# EAGLE design DoorBell (EAGLE 7.7.0)
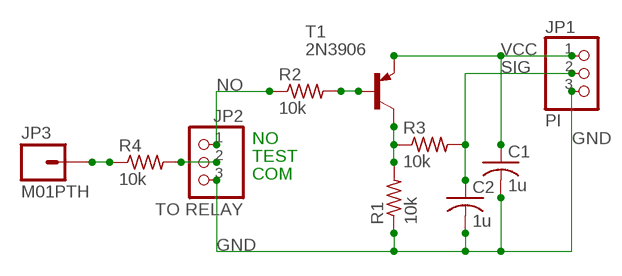
[diagram p0: schematic, sheet 1]

## Parts
C1  1u  C-US025-025X050  [C025-025X050]
C2  1u  C-US025-025X050  [C025-025X050]
JP1  PI  PINHD-1X3  [1X03]
JP2  TO RELAY  PINHD-1X3  [1X03]
JP3  M01PTH  [1X01]
R1  10k  R-US_0204/5  [0204/5]
R2  10k  R-US_0204/5  [0204/5]
R3  10k  R-US_0204/5  [0204/5]
R4  10k  R-US_0204/5  [0204/5]
T1  2N3906  2N3906-PNP-TO92-EBC  [TO92-EBC]

## Nets
GND: C1.2 C2.2 JP1.3 JP2.3 R1.1
N$1: R1.2 R3.1 T1.C
N$2: R2.2 T1.B
N$4: JP2.2 R4.2
N$7: JP3.1 R4.1
NO: JP2.1 R2.1
SIG: C2.1 JP1.2 R3.2
VCC: C1.1 JP1.1 T1.E

## Notes on the sheet
- NO
- TEST
- COM

## Library data of the parts
C1 C2 = rcl:C-US: CAPACITOR, American symbol
JP1 JP2 = pinhead:PINHD-1X3: PIN HEADER
JP3 = SparkFun-Connectors:M01: Header 1 Standard 1-pin 0.1" header. Use with straight break away headers (SKU : PRT-00116), right angle break away headers (PRT-00553), swiss pins (PRT-00743), machine pins (PRT-00117), and female headers (PRT-00115).
R1-R4 = resistor:R-US_: RESISTOR, American symbol
T1 = transistor-neu-to92:*-PNP-: PNP Transistror

## Board
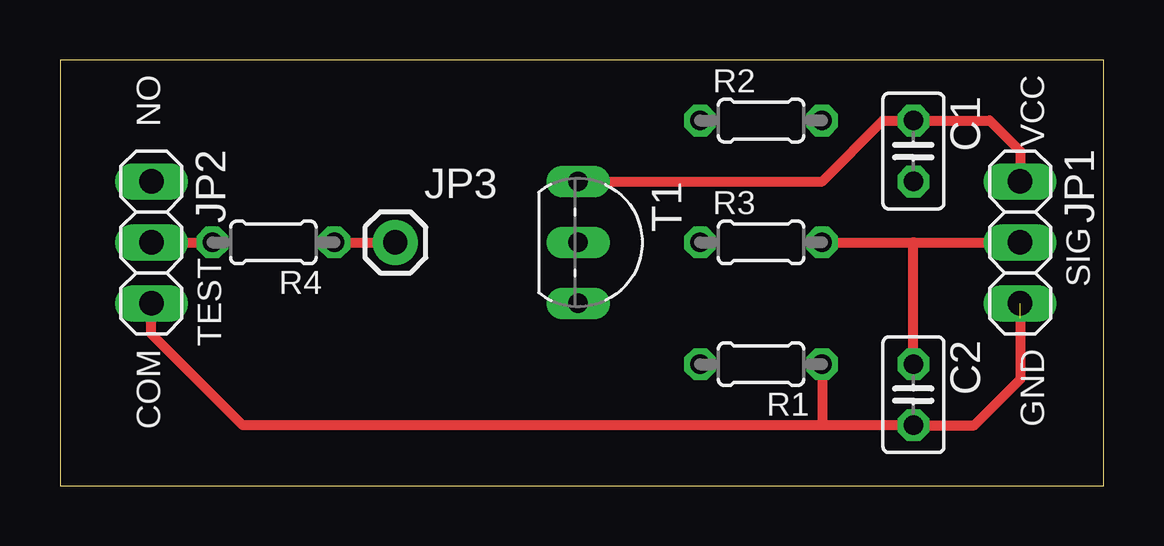
[diagram p1: board, top side]
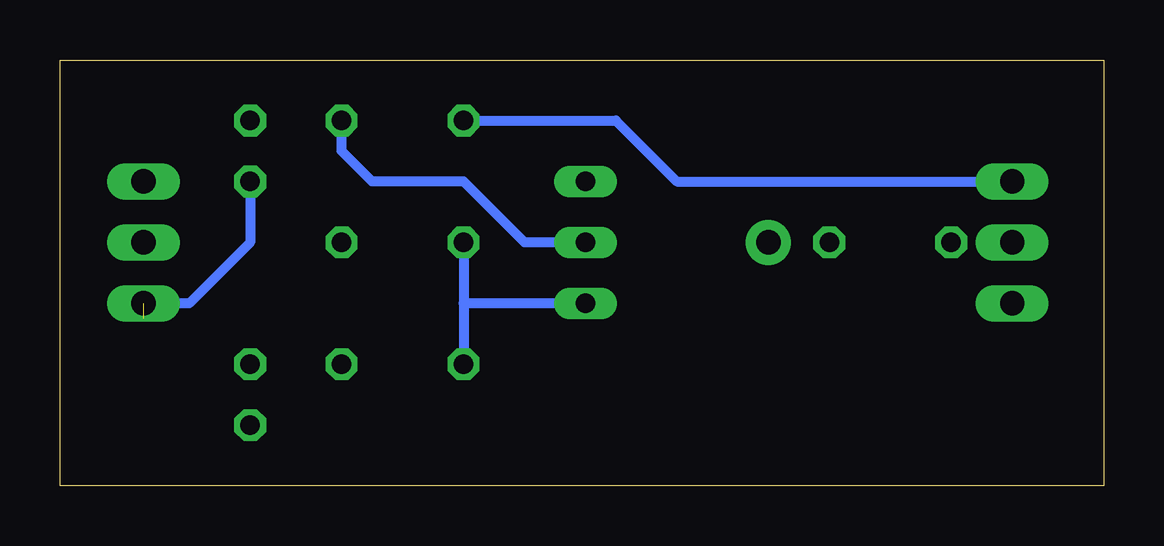
[diagram p2: board, bottom side, seen from below]

Size 43.48 x 17.77 mm. Coordinates in mm from the lower left corner, seen from the top.
Outline: 0,0 43.48,0 43.48,17.77 0,17.77 0,0
Copper layers (1*16): Top 0.035mm / dielectric 1.5mm / Bottom 0.035mm
Design rules "SeeedStudio_2layer_DRU_no_angle_20140221": minimum track width 6mil, minimum drill 12mil, track to track 6mil, track to pad 6mil, pad to pad 6mil, via to via 6mil, smd to smd 0mil, copper to edge 10mil, drill to drill 10mil, minimum pad ring 10mil, minimum via ring 6mil, stop-mask expansion 2mil, vias tented up to drill 100mil, thermal gap 10mil

### Footprints (pad centres in the part's own frame; a part is rotated, then mirrored left to right if it is on the bottom)
C025-025X050 = drill 0.813 octagon: 1 -1.27,0; 2 1.27,0
1X03 = drill 1.016 long: 1 -2.54,0; 2 0,0; 3 2.54,0
1X01 = drill 1.016 pad 1.88: 1 0,0
0204/5 = drill 0.813 octagon: 1 -2.54,0; 2 2.54,0
TO92-EBC = drill 0.813 long: B 0,-1.27; C 2.54,-1.27; E -2.54,-1.27

### Placement (x,y rotation side)
C1  35.56,13.97 270 top
C2  35.56,3.81 270 top
JP1  40.01,10.16 270 top
JP2  3.81,10.16 270 top
JP3  13.97,10.16 0 top
R1  29.21,5.08 180 top
R2  29.21,15.24 0 top
R3  29.21,10.16 0 top
R4  8.89,10.16 180 top
T1  22.86,10.16 270 top

### Tracks (layer width: path | path; a pad name or v marks a point on that pad's centre or on a via)
GND  (1 unrouted)
  Top 0.406: 31.75,2.54 C2.2 38.1,2.54 40.01,4.45 JP1.3 | 31.75,2.54 7.62,2.54 3.81,6.35 JP2.3 | R1.1 31.75,2.54
  Bottom 0.406: C1.2 35.56,10.16 38.1,7.62 JP1.3
N$1
  Bottom 0.406: R3.1 26.67,7.62 | 26.67,7.62 R1.2 | T1.C 26.67,7.62
N$2
  Bottom 0.406: T1.B 24.13,10.16 26.67,12.7 30.48,12.7 31.75,13.97 R2.2
N$4
  Top 0.406: JP2.2 R4.2
N$7
  Top 0.406: R4.1 JP3.1
NO
  Bottom 0.406: R2.1 20.32,15.24 17.78,12.7 JP2.1
SIG
  Top 0.406: R3.2 35.56,10.16 | 35.56,10.16 JP1.2 | C2.1 35.56,10.16
VCC
  Top 0.406: T1.E 31.75,12.7 34.29,15.24 C1.1 38.73,15.24 40.01,13.97 JP1.1

### Text on the board
tNames: NO | VCC | SIG | TEST | COM | GND